# Altium schematic sheet 风扇V1.2.SchDoc: 风扇-衣架
size 304 x 241 mm
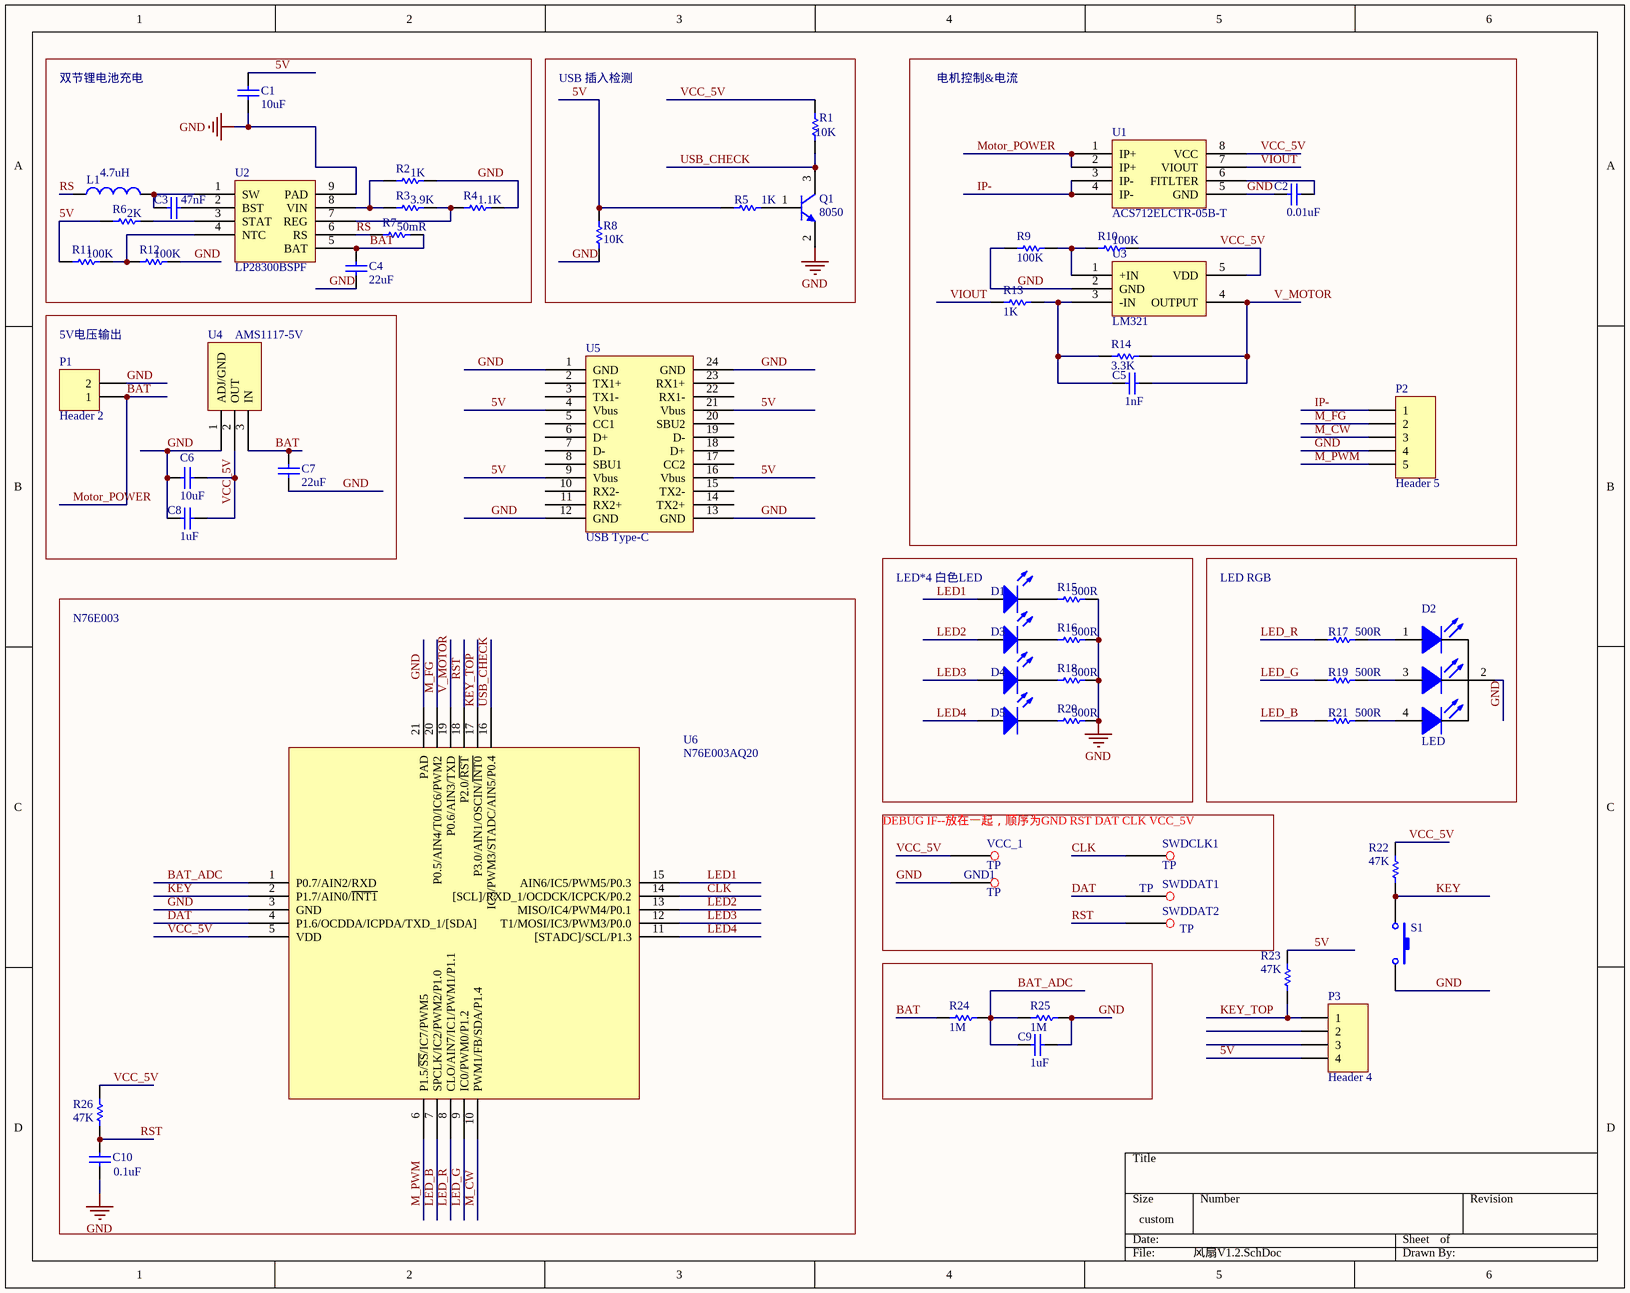
[diagram p0: 风扇V1.2.SchDoc]

## Parts
C1  value 10uF  [c-0402]  (hidden comment: Cap)
C2  value 0.01uF  [c-0402]  (hidden comment: Cap)
C3  value 47nF  [c-0402]  (hidden comment: Cap)
C4  value 22uF  [c-0402]  (hidden comment: Cap)
C5  value 1nF  [c-0402]  (hidden comment: Cap)
C6  value 10uF  [c-0402]  (hidden comment: Cap)
C7  value 22uF  [c-0402]  (hidden comment: Cap)
C8  value 1uF  [c-0402]  (hidden comment: Cap)
C9  value 1uF  [c-0402]  (hidden comment: Cap)
C10  0.1uF  [C-0402]
D1  LED0  [Model Name]  (value not drawn)
D2  LED
D3  LED0  [LED-0]  (value not drawn)
D4  LED0  [LED-0]  (value not drawn)
D5  LED0  [LED-0]  (value not drawn)
GND1  TP  [TP-1.2]
L1  value 4.7uH  [INDC1005AL]  (hidden comment: Inductor)
P1  Header 2  [HDR1X2]
P2  Header 5  [HDR1X5]
P3  Header 4  [HDR1X4]
Q1  8050  [SOT-23]
R1  10K  [R-0402]
R2  value 1K  [R-0402]  (hidden comment: Res1)
R3  value 3.9K  [R-0402]  (hidden comment: Res1)
R4  value 1.1K  [R-0402]  (hidden comment: Res1)
R5  1K  [R-0402]
R6  value 2K  [R-0402]  (hidden comment: Res1)
R7  value 50mR  [R-0402]  (hidden comment: Res1)
R8  value 10K  [R-0402]  (hidden comment: Res1)
R9  value 100K  [R-0402]  (hidden comment: Res1)
R10  value 100K  [R-0402]  (hidden comment: Res1)
R11  value 100K  [R-0402]  (hidden comment: Res1)
R12  value 100K  [R-0402]  (hidden comment: Res1)
R13  value 1K  [R-0402]  (hidden comment: Res1)
R14  value 3.3K  [R-0402]  (hidden comment: Res1)
R15  value 500R  [R-0402]  (hidden comment: Res1)
R16  value 500R  [R-0402]  (hidden comment: Res1)
R17  500R  [R-0402]
R18  value 500R  [R-0402]  (hidden comment: Res1)
R19  500R  [R-0402]
R20  value 500R  [R-0402]  (hidden comment: Res1)
R21  500R  [R-0402]
R22  value 47K  [r-0201]  (hidden comment: Res1)
R23  value 47K  [r-0201]  (hidden comment: Res1)
R24  value 1M  [R-0402]  (hidden comment: Res1)
R25  value 1M  [R-0402]  (hidden comment: Res1)
R26  47K  [R-0402]
S1  SW-PB  [SWITCH]  (value not drawn)
SWDCLK1  TP  [TP-1.2]
SWDDAT1  TP  [TP-1.2]
SWDDAT2  TP  [TP-1.2]
U1  ACS712ELCTR-05B-T  [SOIC8]
U2  LP28300BSPF  [ESOP8]
U3  LM321  [SOT-23-5]
U4  AMS1117-5V
U5  USB Type-C
U6  N76E003AQ20  [QFN-20 0.4mm]
VCC_1  TP  [TP-1.2]

## Blocks framed on the sheet
双节锂电池充电: C1 C3 C4 L1 R2-R4 R6 R7 R11 R12 U2
USB 插入检测: Q1 R1 R5 R8
电机控制&电流: C2 C5 P2 R9 R10 R13 R14 U1 U3
5V电压输出: C6-C8 P1 U4
LED*4 白色LED: D1 D3-D5 R15 R16 R18 R20
LED RGB: D2 R17 R19 R21
N76E003: C10 R26 U6
DEBUG IF--放在一起，顺序为GND RST DAT CLK VCC_5V: GND1 SWDCLK1 SWDDAT1 SWDDAT2 VCC_1

## Nets
GND: C1.2 C2.2 C4.2 C6.1 C7.1 C8.1 C9.1 C10.1 D2.2 GND1.1 P1.2 P2.4 Q1.2(E) R2.1 R4.1 R8.2 R9.1 R12.1 R15.2 R16.2 R18.2 R20.2 R25.2 S1.2 U1.5(GND) U2.9(PAD) U3.2(GND) U4.1(ADJ/GND) U5.1(GND) U5.12(GND) U5.13(GND) U5.24(GND) U6.3(GND) U6.21(PAD)
5V: C1.1 P3.4 R5.1 R6.2 R8.1 R11.2 R23.2 U5.4(Vbus) U5.9(Vbus) U5.16(Vbus) U5.21(Vbus)
BAT: C4.1 C7.2 P1.1 R7.1 R24.1 U1.1(IP+) U1.2(IP+) U2.5(BAT) U4.3(IN)  [also labelled Motor_POWER]
BAT_ADC: C9.2 R24.2 R25.1 U6.1(P0.7/AIN2/RXD)
CLK: SWDCLK1.1 U6.14([SCL]/RXD_1/OCDCK/ICPCK/P0.2)
DAT: SWDDAT1.1 U6.4(P1.6/OCDDA/ICPDA/TXD_1/[SDA])
IP-: P2.1 U1.3(IP-) U1.4(IP-)
KEY: R22.1 S1.1 U6.2(P1.7/AIN0/~{INT1})
KEY_TOP: P3.1 R23.1 U6.17(P3.0/AIN1/OSCIN/~{INT0})
LED1: D1.1(A) U6.15(AIN6/IC5/PWM5/P0.3)
LED2: D3.1(A) U6.13(MISO/IC4/PWM4/P0.1)
LED3: D4.1(A) U6.12(T1/MOSI/IC3/PWM3/P0.0)
LED4: D5.1(A) U6.11([STADC]/SCL/P1.3)
LED_B: R21.1 U6.7(SPCLK/IC2/PWM2/P1.0)
LED_G: R19.1 U6.9(IC0/PWM0/P1.2)
LED_R: R17.1 U6.8(CLO/AIN7/IC1/PWM1/P1.1)
M_CW: P2.3 U6.10(PWM1/FB/SDA/P1.4)
M_FG: P2.2 U6.20(P0.5/AIN4/T0/IC6/PWM2)
M_PWM: P2.5 U6.6(P1.5/~{SS}/IC7/PWM5)
RS: L1.1 R7.2 U2.6(RS)
RST: C10.2 R26.1 SWDDAT2.1 U6.18(P2.0/~{RST})
USB_CHECK: Q1.3(C) R1.1 U6.16(IC3/PWM3/STADC/AIN5/P0.4)
V_MOTOR: C5.1 R14.2 U3.4(OUTPUT) U6.19(P0.6/AIN3/TXD)
VCC_5V: C6.2 C8.2 R1.2 R10.2 R22.2 R26.2 U1.8(VCC) U3.5(VDD) U4.2(OUT) U6.5(VDD) VCC_1.1
VIOUT: R13.1 U1.7(VIOUT)
NetC2_1: C2.1 U1.6(FITLTER)
NetC3_1: C3.1 L1.2 U2.1(SW)
NetC3_2: C3.2 U2.2(BST)
NetC5_2: C5.2 R13.2 R14.1 U3.3(-IN)
NetD1_2: D1.2(K) R15.1
NetD2_1: D2.1 R17.2
NetD2_3: D2.3 R19.2
NetD2_4: D2.4 R21.2
NetD3_2: D3.2(K) R16.1
NetD4_2: D4.2(K) R18.1
NetD5_2: D5.2(K) R20.1
NetQ1_1: Q1.1(B) R5.2
NetR2_2: R2.2 R3.2 U2.8(VIN)
NetR3_1: R3.1 R4.2 U2.7(REG)
NetR6_1: R6.1 U2.3(STAT)
NetR9_2: R9.2 R10.1 U3.1(+IN)
NetR11_1: R11.1 R12.2 U2.4(NTC)

Not connected (* = marked no-connect by the designer): P3 2 3; U5 2(TX1+) 3(TX1-) 5(CC1) 6(D+) 7(D-) 8(SBU1) 10(RX2-) 11(RX2+) 14(TX2+) 15(TX2-) 17(CC2) 18(D+) 19(D-) 20(SBU2) 22(RX1-) 23(RX1+)

## Library data of the parts
C1-C10 = Cap: Capacitor; Published: 8-Jun-2000; LatestRevisionDate: 17-Jul-2002; LatestRevisionNote: Re-released for DXP Platform.; PackageReference: RAD-0.3; Publisher: Altium Limited
  C10: PackageDescription: Radial Cap, Thru-Hole; 2 Leads; 0.3 in Pin Spacing
D1 D3-D5 = LED0: Typical INFRARED GaAs LED; Published: 8-Jun-2000; LatestRevisionDate: 08-Jul-2005; LatestRevisionNote: Mech Layer 1 removed.; PackageReference: LED-0; Publisher: Altium Limited
L1 = Inductor: Code_IEC: 1005; Published: 8-Jun-2000; LatestRevisionDate: 29-May-2009; LatestRevisionNote: IPC-7351 Footprint Added.; PackageReference: 0402-A; Publisher: Altium Limited; PackageDescription: Chip Inductor; Code_JEITA: 0402
P1 = Header 2: Header, 2-Pin; LatestRevisionDate: 17-Jul-2002; LatestRevisionNote: Re-released for DXP Platform.; Publisher: Altium Limited
P2 = Header 5: Header, 5-Pin; LatestRevisionDate: 17-Jul-2002; LatestRevisionNote: Re-released for DXP Platform.; Publisher: Altium Limited
P3 = Header 4: Header, 4-Pin; LatestRevisionDate: 17-Jul-2002; LatestRevisionNote: Re-released for DXP Platform.; Publisher: Altium Limited
Q1 = NPN: NPN Bipolar Transistor; Published: 8-Jun-2000; LatestRevisionDate: 17-Jul-2002; LatestRevisionNote: Re-released for DXP Platform.; PackageReference: TO-226-AA; Publisher: Altium Limited; PackageDescription: TO, Flat Index; 3 In-Line, Axial Leads; Body Dia. 4.8mm; Leads 0.55 x 0.51 mm (max); Code_JEDEC: TO-226-AA
R1-R26 = Res1: Resistor; Published: 8-Jun-2000; LatestRevisionDate: 17-Jul-2002; LatestRevisionNote: Re-released for DXP Platform.; PackageReference: AXIAL-0.3; Publisher: Altium Limited
  R1 R5 R17 R19 R21-R23 R26: PackageDescription: Axial Device, Thru-Hole; 2 Leads; 0.3 in Pin Spacing
S1 = SW-PB: Switch; Published: 24-Mar-1999; LatestRevisionDate: 17-Jul-2002; LatestRevisionNote: Re-released for DXP Platform.; PackageReference: SPST-2; Publisher: Altium Limited; PackageDescription: Switch; 2 Leads
U4 = AMS1117